# EAGLE design Stopper_alap_V14_qfn (EAGLE 6.5.0)
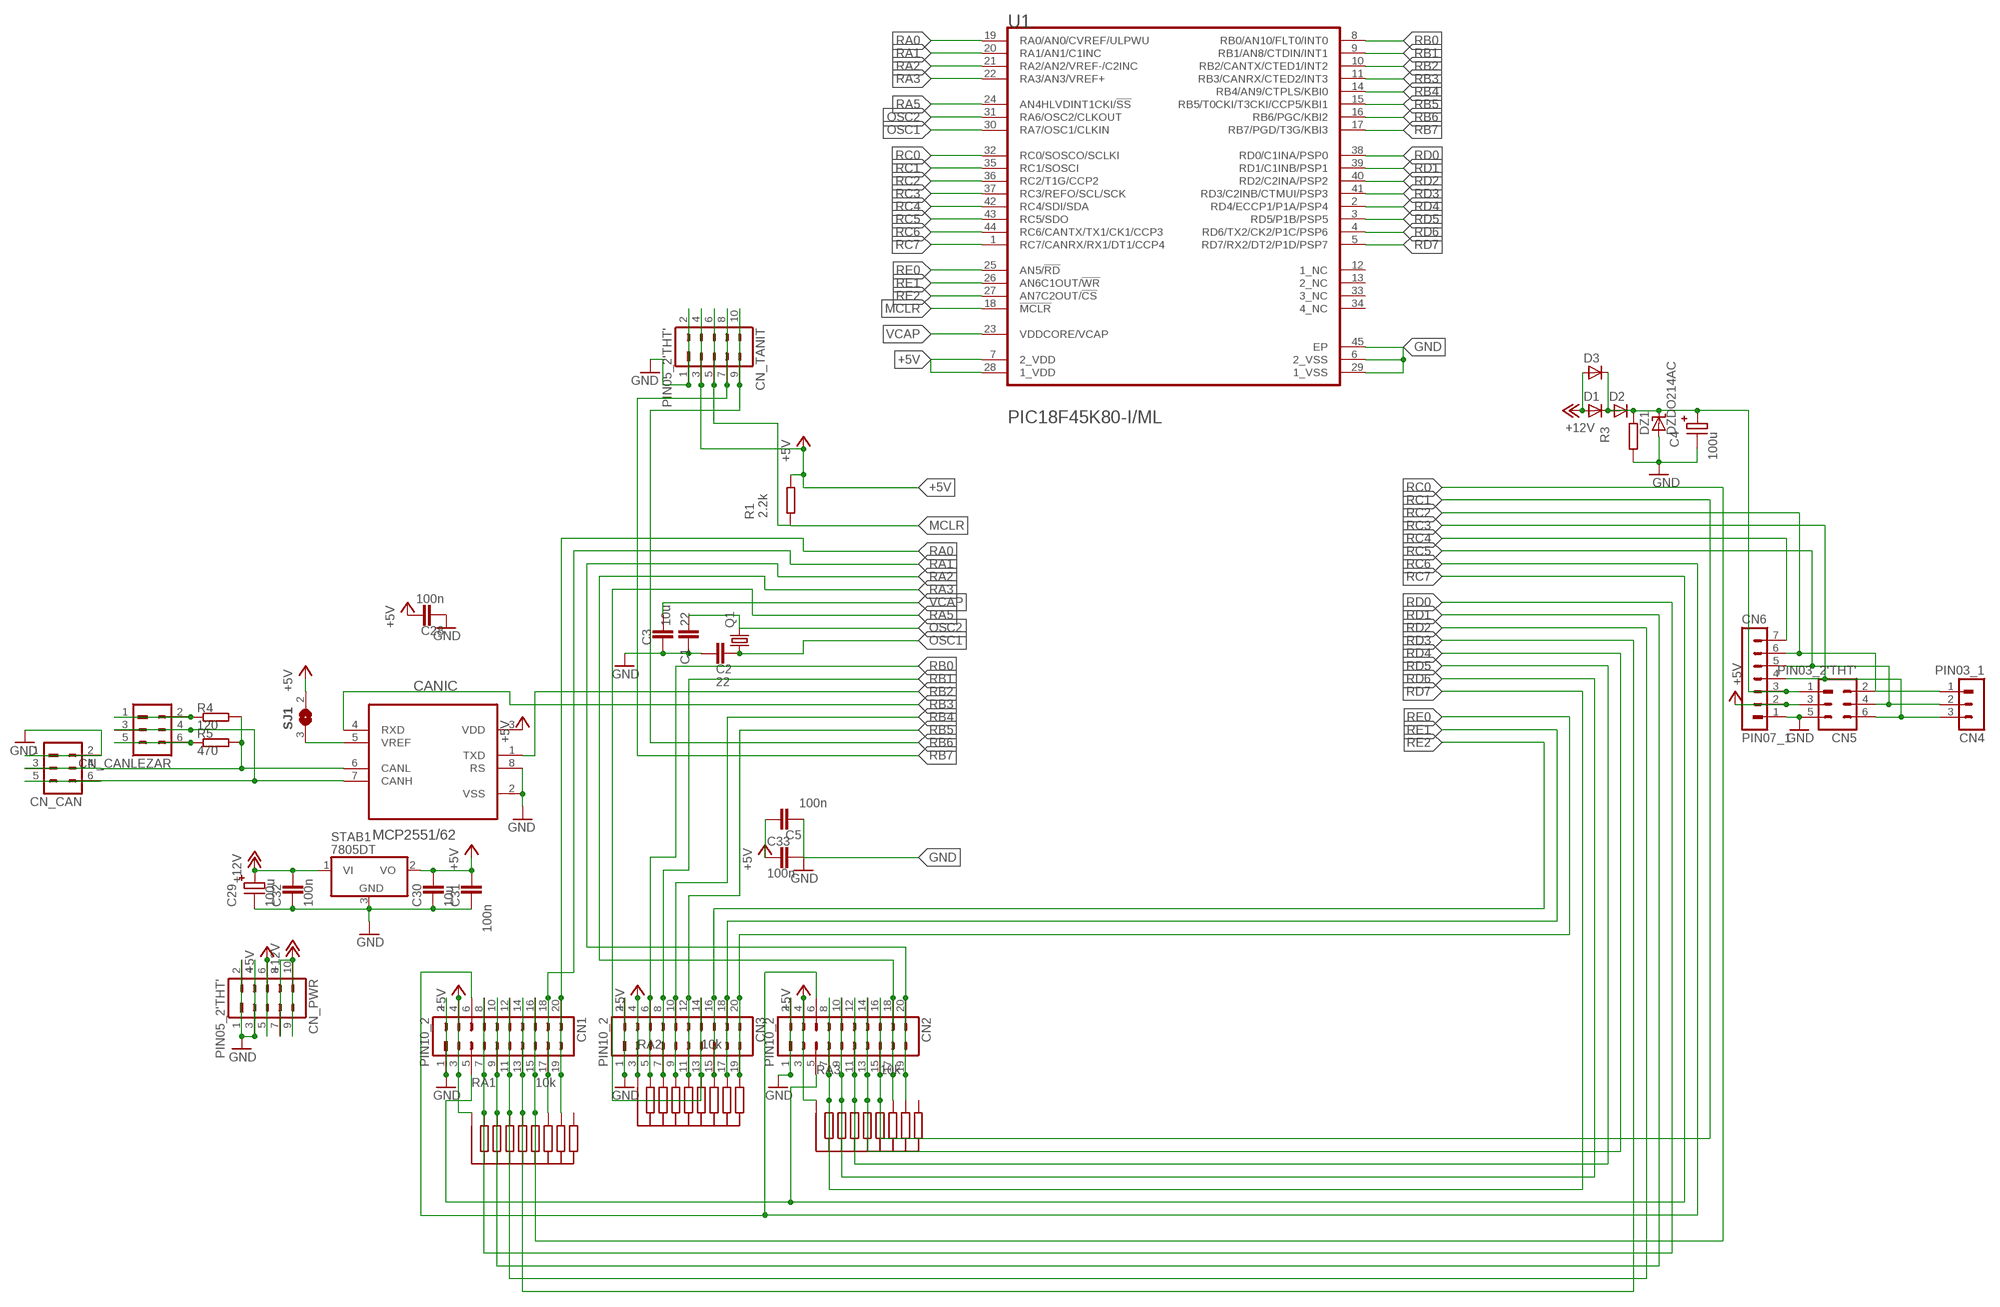
[diagram p0: schematic, sheet 1]

## Parts
C1  22  C0805  [R0805]
C2  22  C0805  [R0805]
C3  10u  C0805  [R0805]
C4  100u  C_EL1R07  [C_EL1RASZT07]
C5  100n  C0805  [R0805]
C28  100n  C0805  [R0805]
C29  100u  C_EL1R07  [C_EL1RASZT07]
C30  10u  C0805  [R0805]
C31  100n  C0805  [R0805]
C32  100n  C0805  [R0805]
C33  100n  C0805  [R0805]
CANIC  MCP2551/62  MCP2551-I/P  [DIP254P762X432-8]
CN1  PIN10_2  [PIN10_2]
CN2  PIN10_2  [PIN10_2]
CN3  PIN10_2  [PIN10_2]
CN4  PIN03_1  [PIN03_1]
CN5  PIN03_2'THT'  [PIN03_2]
CN6  PIN07_1  [PIN07_1]
CN_CAN  PIN03_2'THT'  [PIN03_2]
CN_CANLEZAR  PIN03_2'THT'  [PIN03_2]
CN_PWR  PIN05_2'THT'  [PIN05_2]
CN_TANIT  PIN05_2'THT'  [PIN05_2]
D1  DDO214AC  [DO214AC]
D2  DDO214AC  [DO214AC]
D3  D1RNAGY  [D1RASZTNAGY]
DZ1  DZDO214AC  [DO214AC]
Q1  XTAL_2QS  [XTAL_QS]
R1  2.2k  R_EU0805  [R0805@1]
R3  R_EU0805  [R0805@1]
R4  120  R_EU0805  [R0805@1]
R5  470  R_EU0805  [R0805@1]
RA1  10k  R_ARRAY  [R_ARRAY]
RA2  10k  R_ARRAY  [R_ARRAY]
RA3  10k  R_ARRAY  [R_ARRAY]
SJ1  SJ  [SJ]
STAB1  7805DT  [TO252]
U1  MICROCHIP_PIC18F45K80-I-MLMICROCHIP_PIC18F45K80-I-ML_0_2  [MICROCHIP_PIC18F45K80-I-ML_2]

## Nets
+5V: C5.1 C28.1 C30.1 C31.1 C33.2 CANIC.3(VDD) CN1.3 CN1.4 CN2.3 CN2.4 CN3.3 CN3.4 CN5.3 CN6.2 CN_PWR.5 CN_PWR.6 CN_TANIT.3 CN_TANIT.4 R1.2(E) RA1.P$1(A) RA2.P$1(A) RA3.P$1(A) SJ1.2 STAB1.2(VO) U1.7(2_VDD) U1.28(1_VDD)
+12V: C29.P+ C32.1 CN_PWR.7 CN_PWR.8 CN_PWR.9 CN_PWR.10 D1.A D3.P$1(A) STAB1.1(VI)
GND: C1.2 C2.2 C3.2 C4.P- C5.2 C28.2 C29.P- C30.2 C31.2 C32.2 C33.1 CANIC.2(VSS) CANIC.8(RS) CN1.1 CN1.2 CN2.1 CN2.2 CN3.1 CN3.2 CN5.5 CN6.1 CN_CAN.1 CN_CAN.2 CN_PWR.1 CN_PWR.2 CN_PWR.3 CN_PWR.4 CN_TANIT.1 CN_TANIT.2 DZ1.A R3.1(A) STAB1.3(GND) U1.6(2_VSS) U1.29(1_VSS) U1.45(EP)
MCLR: CN_TANIT.5 CN_TANIT.6 R1.1(A) U1.18(!MCLR!)
N$1: CANIC.5(VREF) SJ1.3
N$7: C4.P+ CN5.1 CN6.3 D1.C D2.A D2.C D3.P$2(C) DZ1.C R3.2(E)
N$15: CN_CANLEZAR.5 CN_CANLEZAR.6 R5.2(E)
N$16: CN_CANLEZAR.1 CN_CANLEZAR.2 R4.1(A)
N$99: CANIC.7(CANH) CN_CAN.5 CN_CAN.6 CN_CANLEZAR.3 CN_CANLEZAR.4
N$131: CANIC.6(CANL) CN_CAN.3 CN_CAN.4 R4.2(E) R5.1(A)
OSC1: C2.1 Q1.1 U1.30(RA7/OSC1/CLKIN)
OSC2: C1.1 Q1.2 U1.31(RA6/OSC2/CLKOUT)
RA0: CN1.19 CN1.20 RA1.P$8(E6) U1.19(RA0/AN0/CVREF/ULPWU)
RA1: CN1.17 CN1.18 RA1.P$7(E5) U1.20(RA1/AN1/C1INC)
RA2: CN2.19 CN2.20 RA3.P$8(E6) U1.21(RA2/AN2/VREF-/C2INC)
RA3: CN2.17 CN2.18 RA3.P$7(E5) U1.22(RA3/AN3/VREF+)
RA5: CN3.13 CN3.14 RA2.P$6(E4) U1.24(AN4HLVDINT1CKI/!SS!)
RB0: CN3.5 CN3.6 RA2.P$2(E) U1.8(RB0/AN10/FLT0/INT0)
RB1: CN3.7 CN3.8 RA2.P$3(E1) U1.9(RB1/AN8/CTDIN/INT1)
RB2: CANIC.1(TXD) U1.10(RB2/CANTX/CTED1/INT2)
RB3: CANIC.4(RXD) U1.11(RB3/CANRX/CTED2/INT3)
RB4: CN3.9 CN3.10 RA2.P$4(E2) U1.14(RB4/AN9/CTPLS/KBI0)
RB5: CN3.11 CN3.12 RA2.P$5(E3) U1.15(RB5/T0CKI/T3CKI/CCP5/KBI1)
RB6: CN_TANIT.9 CN_TANIT.10 U1.16(RB6/PGC/KBI2)
RB7: CN_TANIT.7 CN_TANIT.8 U1.17(RB7/PGD/T3G/KBI3)
RC0: CN1.15 CN1.16 RA1.P$6(E4) U1.32(RC0/SOSCO/SCLKI)
RC1: CN2.15 CN2.16 RA3.P$6(E4) U1.35(RC1/SOSCI)
RC2: CN4.1 CN5.2 CN6.6 U1.36(RC2/T1G/CCP2)
RC3: CN4.3 CN5.6 CN6.4 U1.37(RC3/REFO/SCL/SCK)
RC4: CN6.7 U1.42(RC4/SDI/SDA)
RC5: CN4.2 CN5.4 CN6.5 U1.43(RC5/SDO)
RC6: CN1.6 CN2.6 U1.44(RC6/CANTX/TX1/CK1/CCP3)
RC7: CN1.5 CN2.5 U1.1(RC7/CANRX/RX1/DT1/CCP4)
RD0: CN1.7 CN1.8 RA1.P$2(E) U1.38(RD0/C1INA/PSP0)
RD1: CN1.9 CN1.10 RA1.P$3(E1) U1.39(RD1/C1INB/PSP1)
RD2: CN1.11 CN1.12 RA1.P$4(E2) U1.40(RD2/C2INA/PSP2)
RD3: CN1.13 CN1.14 RA1.P$5(E3) U1.41(RD3/C2INB/CTMUI/PSP3)
RD4: CN2.13 CN2.14 RA3.P$5(E3) U1.2(RD4/ECCP1/P1A/PSP4)
RD5: CN2.11 CN2.12 RA3.P$4(E2) U1.3(RD5/P1B/PSP5)
RD6: CN2.9 CN2.10 RA3.P$3(E1) U1.4(RD6/TX2/CK2/P1C/PSP6)
RD7: CN2.7 CN2.8 RA3.P$2(E) U1.5(RD7/RX2/DT2/P1D/PSP7)
RE0: CN3.19 CN3.20 RA2.P$9(E7) U1.25(AN5/!RD!)
RE1: CN3.17 CN3.18 RA2.P$8(E6) U1.26(AN6C1OUT/!WR!)
RE2: CN3.15 CN3.16 RA2.P$7(E5) U1.27(AN7C2OUT/!CS!)
VCAP: C3.1 U1.23(VDDCORE/VCAP)
Unconnected: RA1.P$9(E7) RA3.P$9(E7) U1.12(1_NC) U1.13(2_NC) U1.33(3_NC) U1.34(4_NC)

## Library data of the parts
C1-C3 C5 C28 C30-C33 = Cf_RLCPX:C
C4 C29 = Cf_RLCPX:C_EL
CANIC = Microchip_By_element14_Batch_1:MCP2551-I/P: High-Speed CAN Transceiver; DESCRIPTION: CAN CTRL; MPN: MCP2551-I/P; OC_FARNELL: 1292240; OC_NEWARK: 61K2947; PACKAGE: PDIP-8; SUPPLIER: Microchip
CN1-CN3 = Cf_Csatl:PIN10_2
CN4 = Cf_Csatl:PIN03_1
CN5 CN_CAN CN_CANLEZAR = Cf_Csatl:PIN03_2
CN6 = Cf_Csatl:PIN07_1
CN_PWR CN_TANIT = Cf_Csatl:PIN05_2
D1-D3 = Cf_Felv:D
DZ1 = Cf_Felv:DZ
Q1 = Cf_RLCPX:XTAL_2
R1 R3-R5 = Cf_RLCPX:R_EU
RA1-RA3 = narval:R_ARRAY
SJ1 = jumper:SJ: SMD solder JUMPER
STAB1 = linear:78*: Positive VOLTAGE REGULATOR Source: http://cache.national.com/ds/LM/LM78L05.pdf http://www.fairchildsemi.com/ds/LM/LM7805.pdf
U1 = ML:MICROCHIP_PIC18F45K80-I-ML: MCHP-PIC18F45_46K80-QFN-44; CIIVA_IDS: 1156993; COMPONENT_LINK_2_DESCRIPTION: Package Specification; COMPONENT_LINK_2_URL: http://www.microchip.com/stellent/groups/techpub_sg/documents/packagingspec/en012702.pdf; COMPONENT_LINK_3_DESCRIPTION: URL Link1; COMPONENT_LINK_3_URL: Product URL:http://www.microchip.com/datasheet/PIC18F45K80; DATASHEET: http://ww1.microchip.com/downloads/en/DeviceDoc/39977f.pdf; DATASHEET_VERSION: Rev. F; DIGITAL_COMMUNICATION: 2 -A/E/USART, 1 -MSSP(SPI/I2C), 0 -SSP(SPI/I2C); EEPROM_DATA_MEMORY_BYTES: 1024; FOOTPRINT_VARIANT_NAME_0: Level C; FOOTPRINT_VARIANT_NAME_1: Level B; FOOTPRINT_VARIANT_NAME_2: Level A; IMPORTED: yes; IMPORTED_FROM: vault; IMPORT_TS: 1521864020; INTERNAL_OSCILLATOR: 16 MHz, 31 kHz; IO_PINS: 35; MAX_CPU_SPEED_MHZ: 64; MEMORY_TYPE: Flash; MF: Microchip; MOUNTING_TECHNOLOGY: Surface Mount; MPN: PIC18F45K80-I/ML; OF_AD_CHANNELS: 11; OPERATION_VOLTAGE_RANGE: 1.8V - 5.5V; PACKAGE: QFN-ML44; PACKAGE_DESCRIPTION: 44-Lead Plastic Quad Flat, 8 x 8 mm Body, 0.65 mm Pitch; PACKAGE_VERSION: C04-103C, 12/2012; PACKING: TUBE; PIN_0_0_14_INSIDE_EDGE: clock; PIN_0_0_15_INSIDE_EDGE: clock; PIN_0_0_23_INSIDE_EDGE: clock; PIN_0_0_29_INSIDE_EDGE: clock; PIN_0_0_31_INSIDE_EDGE: clock; PIN_0_0_36_INSIDE_EDGE: clock; PIN_0_0_3_INSIDE_EDGE: clock; PIN_0_0_43_INSIDE_EDGE: clock; PREFIX: U; PROGRAM_MEMORY_KBYTES: 32; PROGRAM_MEMORY_KWORDS: 16; RAM: 3648; RELEASE_DATE: 1370053096; ROHS: Yes; TIMERS: 2 - 8-bit, 3 - 16-bit; VAULT_GUID: CE6854A9-9697-4090-B66A-B438BDAAA53A; VAULT_REVISION: 9EEA89B8-936B-415F-BACD-3F90B382344D

## Net classes
0 default: width 0.305 mm, clearance 0.305 mm

## Board
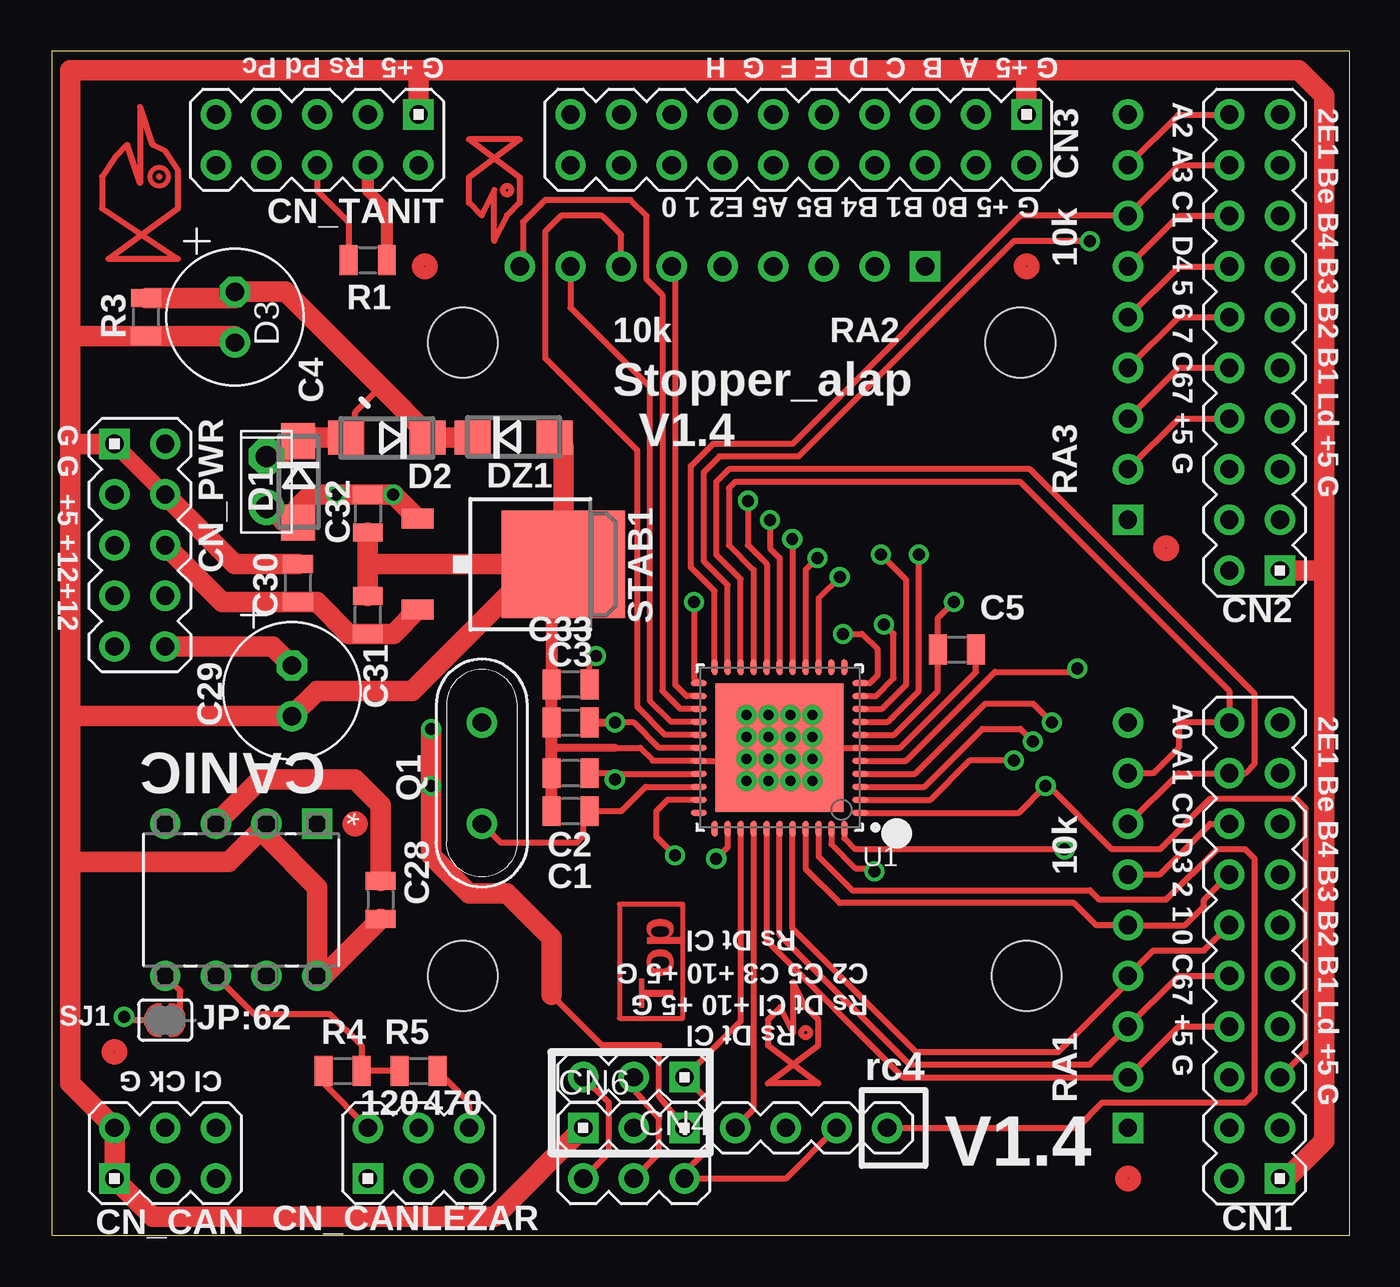
[diagram p1: board, top side]
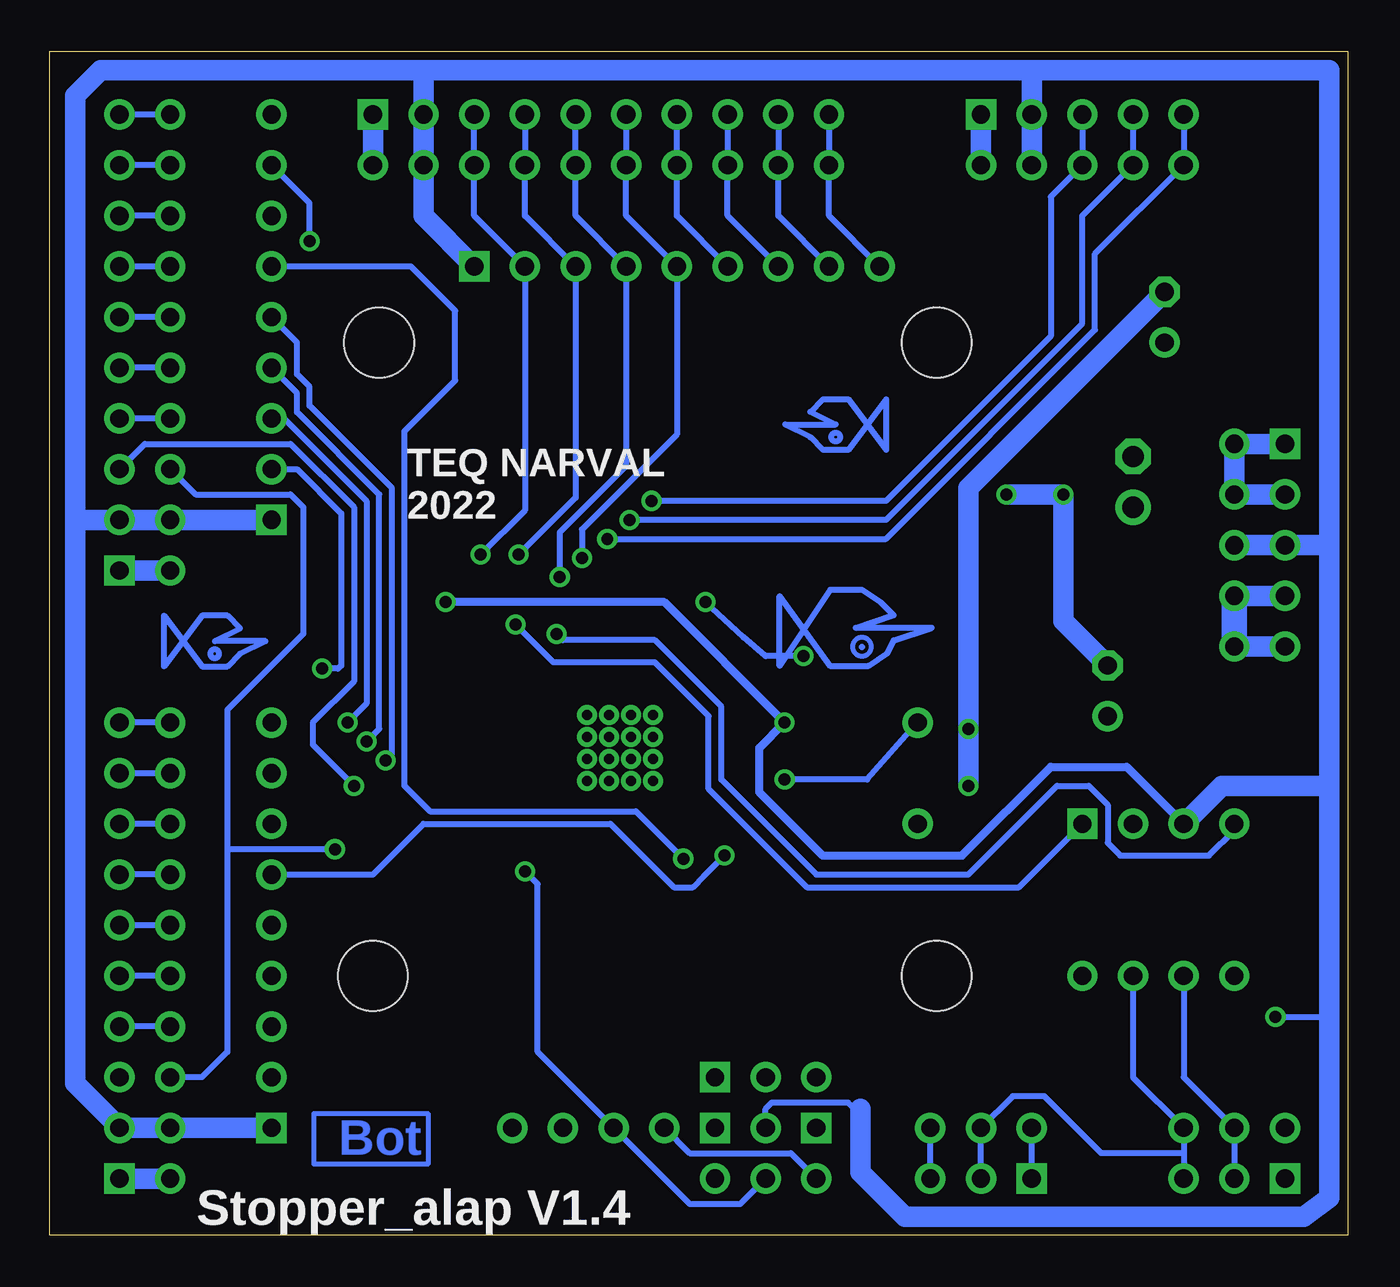
[diagram p2: board, bottom side, seen from below]

Size 65.07 x 59.36 mm. Coordinates in mm from the lower left corner, seen from the top.
Outline: 65.07,59.36 0,59.36 0,0 65.07,0 65.07,59.36
Copper layers (1*16): Top 0.035mm / dielectric 1.5mm / Bottom 0.035mm
Design rules "default *": minimum track width 10mil, minimum drill 24mil, track to track 10mil, track to pad 10mil, pad to pad 10mil, via to via 10mil, smd to smd 0mil, copper to edge 10mil, drill to drill 8mil, minimum pad ring 10mil, minimum via ring 8mil, stop-mask expansion 4mil, vias tented up to drill 0mil, thermal gap 10mil
Holes 3.5 mm at 20.62,44.75 20.62,13 48.56,44.75 48.87,13
tRestrict: area 17.1,41.3 to 24.1,48.3; area 17.1,9.5 to 24.1,16.5; area 45.1,41.3 to 52.1,48.3; area 45.4,9.5 to 52.4,16.5
bRestrict: area 17.1,41.3 to 24.1,48.3; area 17.1,9.5 to 24.1,16.5; area 45.1,41.3 to 52.1,48.3; area 45.4,9.5 to 52.4,16.5

### Footprints (pad centres in the part's own frame; a part is rotated, then mirrored left to right if it is on the bottom)
R0805 = smd 0.9 x 1.5: 1 -0.953,0; 2 0.953,0
C_EL1RASZT07 = drill 0.914 pad 1.524 octagon: P+ 1.27,0 | drill 0.914 pad 1.524: P- -1.27,0
DIP254P762X432-8 = drill 0.914 pad 1.524 square: 1 -3.81,3.81 | drill 0.914 pad 1.524: 2 -3.81,1.27; 3 -3.81,-1.27; 4 -3.81,-3.81; 5 3.81,-3.81; 6 3.81,-1.27; 7 3.81,1.27; 8 3.81,3.81
PIN10_2 = drill 0.914 pad 1.524 square: 1 -10.16,0 | drill 0.914 pad 1.524: 2 -10.16,2.54; 3 -7.62,0; 4 -7.62,2.54; 5 -5.08,0; 6 -5.08,2.54; 7 -2.54,0; 8 -2.54,2.54; 9 0,0; 10 0,2.54; 11 2.54,0; 12 2.54,2.54; 13 5.08,0; 14 5.08,2.54; 15 7.62,0; 16 7.62,2.54; 17 10.16,0; 18 10.16,2.54; 19 12.7,0; 20 12.7,2.54
PIN03_1 = drill 0.914 pad 1.524 square: 1 -2.54,0 | drill 0.914 pad 1.524: 2 0,0; 3 2.54,0
PIN03_2 = drill 0.914 pad 1.524 square: 1 -2.54,0 | drill 0.914 pad 1.524: 2 -2.54,2.54; 3 0,0; 4 0,2.54; 5 2.54,0; 6 2.54,2.54
PIN07_1 = drill 0.914 pad 1.524 square: 1 -7.62,0 | drill 0.914 pad 1.524: 2 -5.08,0; 3 -2.54,0; 4 0,0; 5 2.54,0; 6 5.08,0; 7 7.62,0
PIN05_2 = drill 0.914 pad 1.524 square: 1 -5.08,0 | drill 0.914 pad 1.524: 2 -5.08,2.54; 3 -2.54,0; 4 -2.54,2.54; 5 0,0; 6 0,2.54; 7 2.54,0; 8 2.54,2.54; 9 5.08,0; 10 5.08,2.54
DO214AC = smd 1.8 x 1.7: A 2.05,0; C -2.05,0
D1RASZTNAGY = drill 1.067 pad 1.778: P$1 -1.27,0 | drill 1.067 pad 1.778 octagon: P$2 1.27,0
XTAL_QS = drill 0.914 pad 1.524: 1 -2.54,0; 2 2.54,0
R0805@1 = smd 0.9 x 1.5: 1 -0.953,0; 2 0.953,0
R_ARRAY = drill 0.914 pad 1.524 square: P$1 -10.16,0 | drill 0.914 pad 1.524: P$2 -7.62,0; P$3 -5.08,0; P$4 -2.54,0; P$5 0,0; P$6 2.54,0; P$7 5.08,0; P$8 7.62,0; P$9 10.16,0
SJ = smd 0.508 x 0.508: 1 -0.762,0; 2 0.762,0; 3 -0.762,0; 4 0.762,0
TO252 = smd 1 x 1.6: 1 -2.28,-4.8; 2 2.28,-4.8 | smd 5.4 x 6.2: 3 0,2.5
MICROCHIP_PIC18F45K80-I-ML_2 = smd 0.8 x 0.3: 1 -4.05,3.25; 2 -4.05,2.6; 3 -4.05,1.95; 4 -4.05,1.3; 5 -4.05,0.65; 6 -4.05,0; 7 -4.05,-0.65; 8 -4.05,-1.3; 9 -4.05,-1.95; 10 -4.05,-2.6; 11 -4.05,-3.25; 23 4.05,-3.25; 24 4.05,-2.6; 25 4.05,-1.95; 26 4.05,-1.3; 27 4.05,-0.65; 28 4.05,0; 29 4.05,0.65; 30 4.05,1.3; 31 4.05,1.95; 32 4.05,2.6; 33 4.05,3.25 | smd 0.3 x 0.8: 12 -3.25,-4.05; 13 -2.6,-4.05; 14 -1.95,-4.05; 15 -1.3,-4.05; 16 -0.65,-4.05; 17 0,-4.05; 18 0.65,-4.05; 19 1.3,-4.05; 20 1.95,-4.05; 21 2.6,-4.05; 22 3.25,-4.05; 34 3.25,4.05; 35 2.6,4.05; 36 1.95,4.05; 37 1.3,4.05; 38 0.65,4.05; 39 0,4.05; 40 -0.65,4.05; 41 -1.3,4.05; 42 -1.95,4.05; 43 -2.6,4.05; 44 -3.25,4.05 | smd 6.43 x 6.43: 45 0,0 | drill 0.5: PAD_8 1.65,-1.65; PAD_9 0.55,-1.65; PAD_10 -0.55,-1.65; PAD_11 -1.65,-1.65; PAD_14 1.65,-0.55; PAD_15 0.55,-0.55; PAD_16 -0.55,-0.55; PAD_17 -1.65,-0.55; PAD_20 1.65,0.55; PAD_21 0.55,0.55; PAD_22 -0.55,0.55; PAD_23 -1.65,0.55; PAD_26 1.65,1.65; PAD_27 0.55,1.65; PAD_28 -0.55,1.65; PAD_29 -1.65,1.65

### Placement (x,y rotation side)
C1  26.02,21.26 180 top
C2  26.02,23.16 180 top
C3  26.02,27.61 180 top
C4  9.19,46.02 90 top
C5  45.38,29.36 0 top
C28  16.49,16.82 270 top
C29  12.04,27.29 90 top
C30  12.36,32.69 90 top
C31  15.86,31.1 90 top
C32  15.86,36.18 270 top
C33  26.02,25.71 0 top
CANIC  9.51,16.82 270 top
CN1  61.57,13.01 90 top
CN2  61.57,43.48 90 top
CN3  38.71,56.18 180 top
CN4  29.19,7.92 180 top
CN5  29.19,5.38 180 top
CN6  34.27,5.38 0 top
CN_CAN  5.7,2.84 0 top
CN_CANLEZAR  18.39,2.84 0 top
CN_PWR  3.15,34.59 270 top
CN_TANIT  13.32,56.18 180 top
D1  12.36,37.77 270 top
D2  16.81,39.99 180 top
D3  10.78,37.77 90 top
DZ1  23.16,39.99 0 top
Q1  21.57,23.16 270 top
R1  15.86,48.88 0 top
R3  4.74,46.02 90 top
R4  14.59,8.24 0 top
R5  18.39,8.24 0 top
RA1  53.95,15.54 90 top
RA2  33.63,48.56 180 top
RA3  53.95,46.02 90 top
SJ1  5.7,10.78 180 top
STAB1  23.16,33.64 270 top
U1  36.49,24.44 180 top

### Tracks (layer width: path | path; a pad name or v marks a point on that pad's centre or on a via)
+5V  (via drill 0.6)
  Top 0.305: U1.28 30.46,24.44 29.19,25.71 v28.24,25.71 | U1.7 42.22,25.09 44.43,27.29 C5.1 44.43,30.94 v45.22,31.74 | SJ1.2 3.79,10.78 v3.63,10.94
  Top 0.406: C33.2 v28.24,25.71
  Top 0.61: CN_TANIT.4 15.86,52.38 16.81,51.42 R1.2
  Top 1.016: CN_PWR.6 8.55,31.74 C30.1 13.32,31.74 14.9,30.15 C31.1 17.14,30.15 STAB1.2 | CANIC.3 10.46,22.85 15.22,22.85 16.49,21.58 C28.1
  Bottom 0.305: CN6.2 29.19,6.34 28.87,6.66 25.06,6.66 24.43,6.02 | v3.63,10.94 0.93,10.94
  Bottom 0.406: CANIC.3 11.09,23.48 14.9,23.48 19.35,19.04 26.33,19.04 29.51,22.21 29.51,24.44 v28.24,25.71 34.27,31.74 v45.22,31.74
  Bottom 1.016: CN_PWR.6 CN_PWR.5 0.93,34.6 | 0.93,34.6 0.93,58.41 15.86,58.41 | 15.86,58.41 46.33,58.41 | 46.33,58.41 62.53,58.41 63.8,57.14 63.8,35.86 | 63.8,35.86 63.8,7.61 CN1.3 CN1.4 RA1.P$1 | CN_TANIT.4 CN_TANIT.3 15.86,58.41 | 46.33,58.41 CN3.3 CN3.4 46.33,51.1 RA2.P$1 | RA3.P$1 CN2.4 CN2.3 63.8,35.86 | 0.93,22.53 0.93,10.94 0.93,1.89 2.2,0.94 22.21,0.94 24.43,3.16 24.43,6.02 24.43,6.34 | CANIC.3 6.33,22.53 0.93,22.53 | 0.93,22.53 0.93,34.6
+12V  (via drill 0.61)
  Top 0.305: 12.22,35.86 D1.A
  Top 0.813: D3.P$1 11.55,35.72 D1.A
  Top 1.016: CN_PWR.10 11.09,29.51 C29.P+ | D1.A 12.36,36.5 13,37.14 v14.27,37.14 C32.1 v17.12,37.14 17.14,37.14 STAB1.1
  Bottom 1.016: CN_PWR.9 CN_PWR.10 | C29.P+ 14.27,30.78 v14.27,37.14 v17.12,37.14 | CN_PWR.8 CN_PWR.7
  Bottom 1.27: CN_PWR.8 CN_PWR.10
GND
  Top 0.305: 28.24,24.44 29.51,24.44 30.14,23.8 32.43,23.8 U1.29 35.84,23.78 U1.45 U1.6 42.52,24.44 46.33,28.25 C5.2
  Top 0.406: 28.24,24.44 25.06,24.44
  Top 0.61: C1.2 C2.2 25.06,24.44 C33.1 C3.2 25.06,33.64 STAB1.3
  Top 0.813: CN_PWR.1 CN_PWR.4
  Top 1.016: CN_PWR.4 9.19,33.64 C30.2 | DZ1.A 25.66,39.54 25.66,34.28 | 25.66,34.28 STAB1.3 15.86,33.64 | C32.2 15.86,33.64 | 15.86,33.64 C31.2 | 25.66,34.28 25.06,34.28 18.08,27.29 13.32,27.29 C29.P- 0.93,26.02 | 0.93,18.72 0.93,7.61 CN_CAN.2 CN_CAN.1 5.06,0.94 22.21,0.94 CN6.1 | 0.93,26.02 0.93,39.68 | 18.39,58.41 0.93,58.41 0.93,45.07 | 18.39,58.41 49.19,58.41 | 49.19,58.41 62.53,58.41 63.8,57.14 63.8,33.32 | 63.8,33.32 63.8,4.75 61.89,2.84 CN1.1 | CN2.1 63.8,33.32 | CN3.1 48.88,58.09 49.19,58.41 | CN_TANIT.1 18.39,58.41 | CN_PWR.1 0.93,39.68 | 0.93,39.68 0.93,45.07 | C28.2 13.63,13.01 CANIC.8 13.32,17.45 10.78,19.99 CANIC.2 8.87,18.72 0.93,18.72 | C4.P- 9.19,45.07 R3.1 0.93,45.07 | 0.93,18.72 0.93,26.02
  Bottom 1.016: CN_PWR.3 CN_PWR.4 CN_PWR.2 CN_PWR.1 | CN_TANIT.2 CN_TANIT.1 | CN3.2 CN3.1 | CN2.1 CN2.2 | CN1.2 CN1.1
HALACSKA1
  Top 0.305: 23.46,54.93 20.92,54.93 23.46,53.03 23.46,51.76 22.83,51.12 22.19,49.85 22.19,52.39 21.56,51.12 20.92,51.76 20.92,53.03 23.46,54.93
HALACSKA2
  Top 0.305: 38.44,7.62 35.9,7.62 38.44,9.52 38.44,10.79 37.81,11.43 37.17,12.7 37.17,10.16 36.54,11.43 35.9,10.79 35.9,9.52 38.44,7.62
HALACSKA3
  Bottom 0.305: 28.49,28.55 28.49,32.04 25.95,28.55 24.05,28.55 23.1,29.18 22.78,29.82 20.87,30.45 24.68,30.45 22.78,31.09 23.41,31.72 24.37,32.36 25.95,32.36 28.49,28.55
HALACSKA4
  Bottom 0.305: 23.14,39.37 23.14,41.91 25.04,39.37 26.31,39.37 26.95,40.01 28.22,40.64 25.68,40.64 26.95,41.28 26.31,41.91 25.04,41.91 23.14,39.37
HALACSKA5
  Top 0.305: 6.35,48.94 2.85,48.94 6.35,51.48 6.35,53.39 5.71,54.34 5.08,54.66 4.44,56.56 4.44,52.75 3.81,54.66 3.17,54.02 2.54,53.07 2.54,51.48 6.35,48.94
HALACSKA6
  Bottom 0.305: 59.34,28.52 59.34,31.06 57.44,28.52 56.17,28.52 55.53,29.15 54.26,29.79 56.8,29.79 55.53,30.42 56.17,31.06 57.44,31.06 59.34,28.52
MCLR  (via drill 0.6)
  Top 0.305: CN_TANIT.6 13.32,52.38 14.9,50.79 R1.1 | v34.9,36.82 34.9,34.6 35.86,33.64 35.86,28.5 U1.18
  Bottom 0.305: CN_TANIT.5 CN_TANIT.6 14.9,52.06 14.9,45.07 23.16,36.82 v34.9,36.82
N$1
  Top 0.305: SJ1.3 6.46,12.24 CANIC.5
N$7  (via drill 0.61)
  Top 0.305: 16.49,42.53 15.22,41.26 15.22,39.68 14.9,39.99 D2.A | CN6.3 30.46,6.97 30.46,9.51 27.6,9.51 25.06,12.05
  Top 0.813: D3.P$2 11.58,39.04 D1.C
  Top 1.016: D2.C 19.03,39.99 | DZ1.C 19.03,39.99 | R3.2 9.19,46.98 C4.P+ 11.73,47.29 16.49,42.53 19.03,39.99 | 25.06,12.05 25.06,14.91 22.84,17.13 20.93,17.13 19.03,19.04 v19.03,25.39 v19.03,22.53 | D1.C 12.36,39.99 D2.A
  Bottom 1.016: v19.03,22.53 v19.03,25.39 19.03,37.45 C4.P+
N$15
  Top 0.305: R5.2 20.93,6.66 CN_CANLEZAR.6
  Bottom 0.305: CN_CANLEZAR.5 CN_CANLEZAR.6
N$16
  Top 0.305: CN_CANLEZAR.2 13.63,7.61 R4.1
  Bottom 0.305: CN_CANLEZAR.1 CN_CANLEZAR.2
N$99
  Bottom 0.305: CANIC.7 10.78,7.93 CN_CAN.6 8.24,4.12 | 8.24,4.12 CN_CAN.5 | CN_CANLEZAR.3 CN_CANLEZAR.4 16.81,6.97 15.22,6.97 12.36,4.12 8.24,4.12
N$131
  Top 0.305: R5.1 R4.2 15.54,9.51 13.95,11.1 10.14,11.1 CANIC.6
  Bottom 0.305: CANIC.6 8.24,7.93 CN_CAN.4 CN_CAN.3
N$298
  Bottom 0.254: 51.83,3.57 51.83,6.11 46.11,6.11 46.11,3.57 51.83,3.57
N$312
  Top 0.254: 28.47,10.88 31.64,10.88 31.64,16.59 28.47,16.59 28.47,10.88
OSC1  (via drill 0.61)
  Top 0.305: C2.1 27.92,23.16 v28.24,22.85 28.53,23.14 U1.30
  Bottom 0.305: Q1.1 24.11,22.85 v28.24,22.85
OSC2
  Top 0.305: Q1.2 22.52,19.67 26.33,19.67 26.65,19.99 26.65,21.58 C1.1 28.55,21.26 29.78,22.48 U1.31
RA0
  Top 0.305: RA1.P$8 55.22,23.16 56.49,24.44 56.49,25.71 CN1.20 59.03,27.29 48.56,37.77 34.27,37.77 33.95,37.45 33.95,34.6 35.19,33.35 U1.19
  Bottom 0.305: CN1.20 CN1.19
RA1
  Top 0.305: RA1.P$7 56.49,23.16 CN1.18 59.83,23.16 60.3,23.64 60.3,27.13 49.03,38.4 33.95,38.4 33.32,37.77 33.32,34.12 34.54,32.89 U1.20
  Bottom 0.305: CN1.18 CN1.17
RA2  (via drill 0.61)
  Top 0.305: RA3.P$8 56.49,56.18 CN2.20 | U1.21 33.89,32.59 32.68,33.8 32.68,38.25 33.48,39.04 37.45,39.04 48.24,49.83 v52.05,49.83
  Bottom 0.305: v52.05,49.83 52.05,51.74 RA3.P$8 | CN2.20 CN2.19
RA3
  Top 0.305: CN2.18 56.49,53.64 RA3.P$7 48.56,51.1 37.13,39.68 33.16,39.68 32.05,38.56 32.05,33.48 33.24,32.29 U1.22
  Bottom 0.305: CN2.18 CN2.17
RA5
  Top 0.305: RA2.P$6 31.25,48.25 31.25,27.61 31.83,27.03 U1.24
  Bottom 0.305: RA2.P$6 33.63,51.1 CN3.14 CN3.13
RB0  (via drill 0.6)
  Top 0.305: U1.8 41.92,25.73 43.48,27.29 v43.48,34.12
  Bottom 0.305: CN3.5 CN3.6 43.79,51.1 RA2.P$2 41.25,36.34 v43.48,34.12
RB1  (via drill 0.6)
  Top 0.305: U1.9 41.62,26.39 42.84,27.61 42.84,32.85 v41.57,34.12
  Bottom 0.305: CN3.7 CN3.8 41.25,51.1 RA2.P$3 38.71,36.98 41.18,34.52 v41.57,34.12
RB2  (via drill 0.6)
  Top 0.305: U1.10 41.31,27.03 42.21,27.93 42.21,30.15 v41.73,30.63
  Bottom 0.305: CANIC.1 16.49,17.45 27.13,17.45 32.05,22.37 32.05,26.02 34.75,28.72 39.83,28.72 v41.73,30.63
RB3  (via drill 0.6)
  Top 0.305: U1.11 41.01,27.69 41.41,28.09 41.41,29.36 40.62,30.15 v39.67,30.15
  Bottom 0.305: CANIC.4 5.7,20.31 6.97,19.04 11.41,19.04 12.04,19.67 12.04,21.58 13,22.53 14.59,22.53 19.03,18.09 26.65,18.09 31.41,22.85 31.41,26.5 34.75,29.83 39.35,29.83 v39.67,30.15
RB4  (via drill 0.6)
  Top 0.305: v39.51,33.01 38.44,31.94 U1.14
  Bottom 0.305: CN3.9 CN3.10 38.71,51.1 RA2.P$4 36.17,38.56 39.51,35.23 v39.51,33.01
RB5  (via drill 0.6)
  Top 0.305: v38.4,33.96 37.79,33.35 U1.15
  Bottom 0.305: CN3.11 CN3.12 36.17,51.1 RA2.P$5 33.63,40.15 38.4,35.39 v38.4,33.96
RB6  (via drill 0.6)
  Top 0.305: v37.13,34.91 37.14,34.9 U1.16
  Bottom 0.305: CN_TANIT.9 CN_TANIT.10 12.68,49.2 12.68,45.39 23.16,34.91 v37.13,34.91
RB7  (via drill 0.6)
  Top 0.305: v36.02,35.86 36.02,34.44 36.49,33.96 U1.17
  Bottom 0.305: CN_TANIT.7 CN_TANIT.8 13.32,51.1 13.32,45.71 23.16,35.86 v36.02,35.86
RC0  (via drill 0.6)
  Top 0.305: RA1.P$6 55.54,18.09 58.08,20.62 CN1.16 | U1.32 30.88,21.84 30.3,21.26 30.3,19.99 v31.25,19.04
  Bottom 0.305: CN1.16 CN1.15 | RA1.P$6 48.88,18.09 46.33,20.62 36.97,20.62 33.79,17.45 32.84,17.45 32.29,18.01 v31.25,19.04
RC1  (via drill 0.6)
  Top 0.305: RA3.P$6 56.49,51.1 CN2.16 | U1.35 33.89,19.45 v33.32,18.88
  Bottom 0.305: RA3.P$6 46.97,48.57 44.75,46.34 44.75,42.85 47.29,40.31 47.29,22.53 46.02,21.26 35.7,21.26 33.87,19.43 v33.32,18.88 | CN2.16 CN2.15
RC2
  Top 0.305: CN6.6 36.81,2.84 CN5.2 31.73,3.16 33,4.43 33,6.66 CN4.1 34.54,10.74 U1.36
RC3
  Top 0.305: CN4.3 27.92,6.66 27.92,4.12 CN5.6 | U1.37 35.19,6.31 CN6.4
  Bottom 0.305: CN5.6 27.92,4.12 33,4.12 CN6.4
RC4
  Top 0.305: CN6.7 51.41,5.38 52.68,6.66 59.83,6.66 60.3,7.13 60.3,18.88 59.83,19.35 58.4,19.35 55.86,16.82 52.53,16.82 52.05,17.29 40.14,17.29 38.44,18.99 U1.42
RC5  (via drill 0.6)
  Top 0.305: CN5.4 30.46,4.12 30.46,5.86 29.19,7.29 CN4.2 | U1.43 39.09,19.61 40.3,18.4 41.1,18.4 v41.25,18.24
  Bottom 0.305: CN5.4 30.46,1.57 33,1.57 CN6.5 40.62,9.19 40.62,17.61 v41.25,18.24
RC6  (via drill 0.6)
  Top 0.305: v50.78,19.35 40.3,19.35 39.74,19.91 U1.44
  Bottom 0.305: 56.18,19.35 56.18,9.19 57.45,7.93 CN1.6 | CN2.6 57.76,37.14 53,37.14 52.37,36.5 52.37,30.15 56.18,26.34 56.18,19.35 | v50.78,19.35 56.18,19.35
RC7  (via drill 0.6)
  Top 0.305: U1.1 48.48,21.19 v49.83,22.53 49.99,22.53 53.16,19.35 55.54,19.35 58.08,21.89 62.37,21.89 62.84,21.42 62.84,9.19 CN1.5
  Bottom 0.305: CN2.5 60.3,39.68 53,39.68 49.83,36.5 49.83,27.77 51.89,25.71 51.89,24.59 v49.83,22.53
RD0
  Top 0.305: CN1.8 56.49,10.46 RA1.P$2 42.68,7.93 35.86,14.75 35.86,20.37 U1.38
  Bottom 0.305: CN1.8 CN1.7
RD1
  Top 0.305: CN1.10 56.49,13.01 RA1.P$3 52.05,8.56 43,8.56 36.49,15.07 U1.39
  Bottom 0.305: CN1.10 CN1.9
RD2
  Top 0.305: CN1.12 57.76,14.27 55.22,14.27 RA1.P$4 53.95,12.69 50.46,9.19 43.32,9.19 37.13,15.39 37.13,20.37 U1.40
  Bottom 0.305: CN1.12 CN1.11
RD3
  Top 0.305: CN1.14 57.76,16.82 57.76,16.5 56.81,15.54 RA1.P$5 52.37,15.54 51.26,16.66 39.51,16.66 37.79,18.37 U1.41
  Bottom 0.305: CN1.14 CN1.13
RD4  (via drill 0.6)
  Top 0.305: RA3.P$5 56.49,48.57 CN2.14 | v48.24,23.8 46.02,23.8 44.05,21.84 U1.2
  Bottom 0.305: RA3.P$5 52.68,44.75 52.68,43.17 52.05,42.53 52.05,41.58 47.92,37.45 47.92,24.12 v48.24,23.8 | CN2.14 CN2.13
RD5  (via drill 0.6)
  Top 0.305: RA3.P$4 56.49,46.03 CN2.12 | U1.3 43.75,22.48 46.65,25.39 48.56,25.39 v49.19,24.75
  Bottom 0.305: RA3.P$4 52.68,42.21 52.68,41.26 48.56,37.14 48.56,25.39 v49.19,24.75 | CN2.12 CN2.11
RD6  (via drill 0.6)
  Top 0.305: RA3.P$3 56.49,43.49 CN2.10 | U1.4 43.29,23.14 46.81,26.66 49.19,26.66 v50.14,25.71
  Bottom 0.305: RA3.P$3 53.32,40.95 49.19,36.82 49.19,26.66 v50.14,25.71 | CN2.10 CN2.9
RD7  (via drill 0.6)
  Top 0.305: RA3.P$2 56.49,40.95 CN2.8 | U1.5 42.83,23.78 47.29,28.25 51.26,28.25 v51.41,28.4
  Bottom 0.305: RA3.P$2 52.68,38.4 50.46,36.18 50.46,28.56 50.62,28.4 v51.41,28.4 | CN2.8 CN2.7
RE0
  Top 0.305: RA2.P$9 23.63,48.72 23.63,50.79 24.75,51.9 29.03,51.9 29.82,51.1 29.82,47.93 30.62,47.14 30.62,27.29 31.53,26.39 U1.25
  Bottom 0.305: RA2.P$9 26.02,51.1 CN3.20 CN3.19
RE1
  Top 0.305: RA2.P$8 26.02,46.5 29.98,42.53 29.98,26.82 31.07,25.73 U1.26
  Bottom 0.305: RA2.P$8 28.55,51.1 CN3.18 CN3.17
RE2
  Top 0.305: RA2.P$7 28.55,50.15 27.6,51.1 25.54,51.1 24.75,50.31 24.75,43.96 29.35,39.36 29.35,26.5 30.76,25.09 U1.27
  Bottom 0.305: RA2.P$7 31.09,51.1 CN3.16 CN3.15
VCAP  (via drill 0.6)
  Top 0.305: C3.1 26.97,28.72 v27.29,29.04 | v32.21,31.74 32.21,27.92 U1.23
  Bottom 0.305: v27.29,29.04 29.19,29.04 30.3,29.99 v32.21,31.74
(copper drawn outside any net)
  shapes: Bottom circle x4, Top circle x10

### Text on the board
Top: Top
Bottom: Bot
Unrouted: a keretes 2x3 pól. a felülről ültetendő
tPlace: Stopper_alap / V1.4 | rc4 | V1.4
tNames: G +5 Rs Pd Pc | G +5 A B C D E F G H | A2 A3 C1 D4 5 6 7 C67 +5 G | 2E1 Be B4 B3 B2 B1 Ld +5 G | G +5 B0 B1 B4 B5 A5 E2 1 0 | G G +5 +12+12 | A0 A1 C0 D3 2 1 0 C67 +5 G | 2E1 Be B4 B3 B2 B1 Ld +5 G | Rs Dt Cl | C2 C5 C3 +10 +5 G | Rs Dt Cl / Rs Dt Cl +10 +5 G | JP:62 | Cl Ck G
bNames: TEQ NARVAL / 2022 | Stopper_alap V1.4